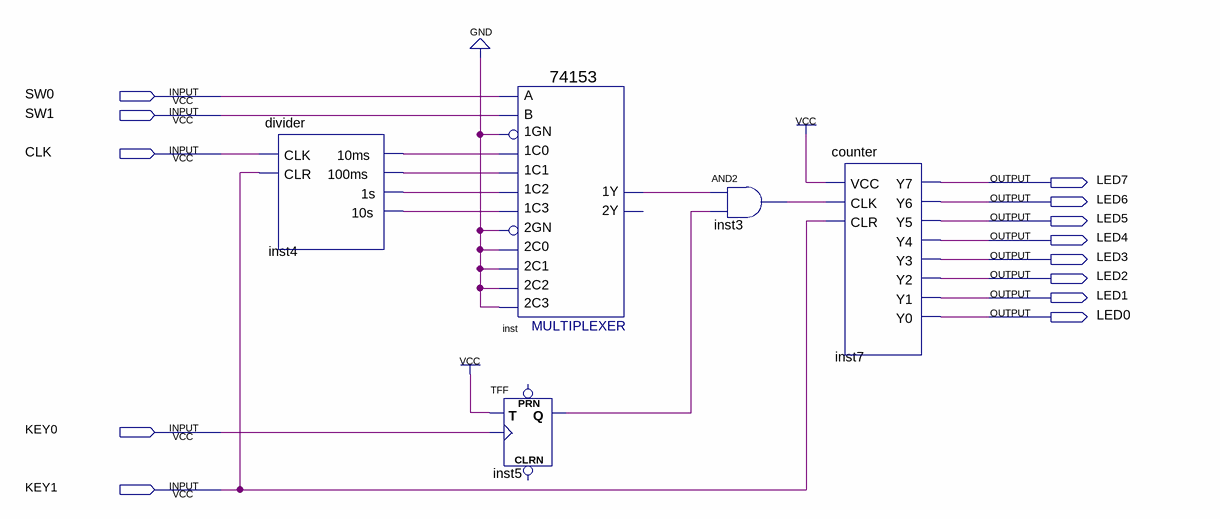
[diagram p0: schematic sheet]
// Quartus schematic hw01_simakma5.bdf as structural Verilog: 5 symbols, 13 pins
module hw01_simakma5 (
  input  SW0,
  input  SW1,
  input  CLK,
  input  KEY0,
  input  KEY1,
  output LED7,
  output LED6,
  output LED5,
  output LED4,
  output LED3,
  output LED2,
  output LED1,
  output LED0
);

  wire inst3_out, inst4_1s, inst4_10ms, inst4_10s, inst4_100ms, inst5_q, inst_1y;

  divider inst4 (.CLK(CLK), .CLR(KEY1), .\10ms (inst4_10ms), .\100ms (inst4_100ms), .\1s (inst4_1s), .\10s (inst4_10s));
  \74153  inst (
    .\1C1 (inst4_100ms), .\1GN (1'b0), .\1C0 (inst4_10ms), .\2C0 (1'b0), .\2GN (1'b0), .\2C2 (1'b0),
    .\1C2 (inst4_1s), .\1C3 (inst4_10s), .B(SW1), .A(SW0), .\2C1 (1'b0), .\2C3 (1'b0), .\1Y (inst_1y));  // open: 2Y
  TFF inst5 (.T(1'b1), .CLK(KEY0), .Q(inst5_q));  // open: PRN, CLRN
  and inst3 (inst3_out, inst_1y, inst5_q);
  counter inst7 (
    .VCC(1'b1), .CLK(inst3_out), .CLR(KEY1), .Y7(LED7), .Y6(LED6), .Y5(LED5), .Y4(LED4), .Y3(LED3),
    .Y2(LED2), .Y1(LED1), .Y0(LED0));
endmodule
